# EAGLE design zero shield (EAGLE 6.5.0)
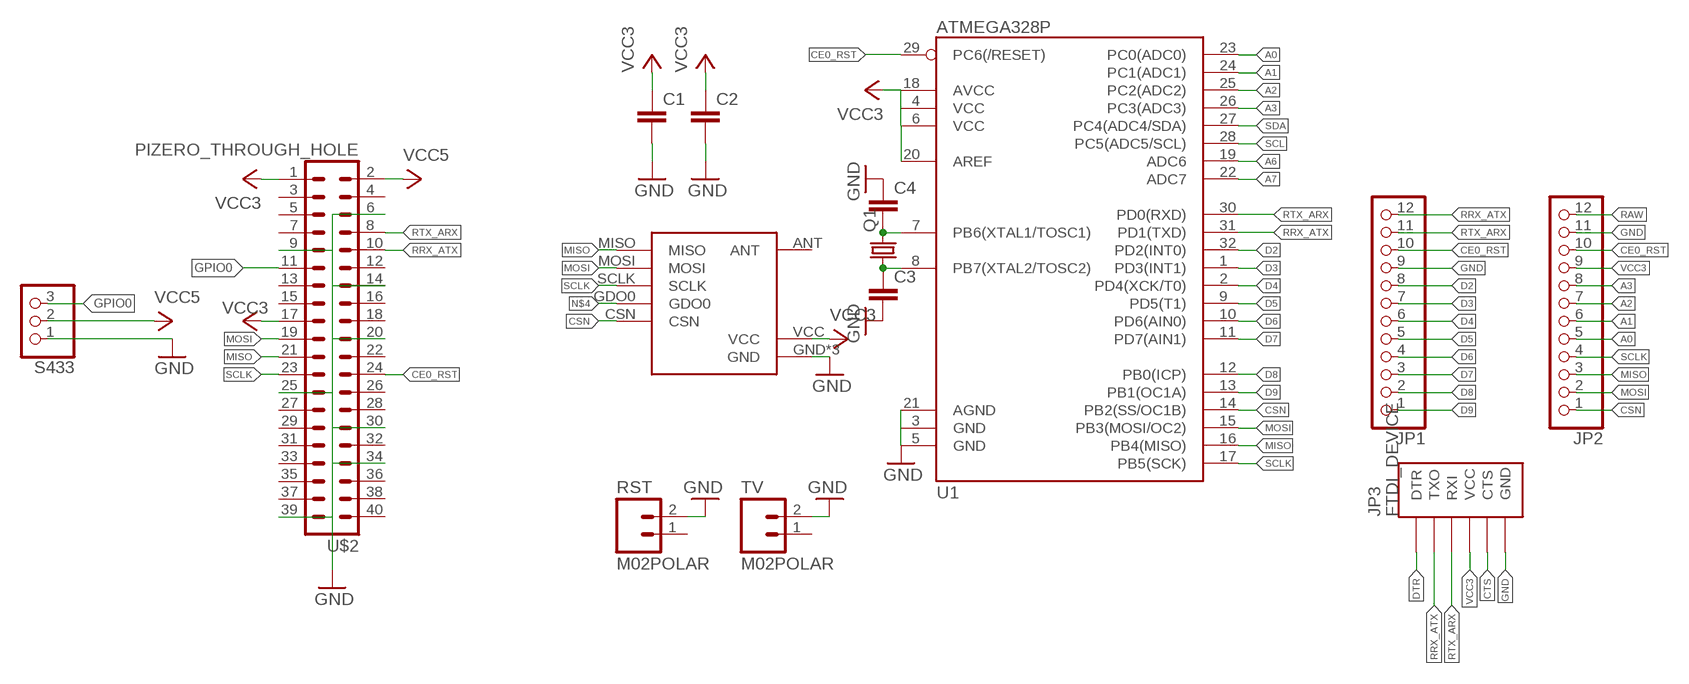
[diagram p0: schematic, sheet 1]

## Parts
C1  C-EUC1206K  [C1206K]
C2  C-EUC1206K  [C1206K]
C3  C-EUC1206K  [C1206K]
C4  C-EUC1206K  [C1206K]
JP1  PINHD-1X12-CB  [1X12-CB]
JP2  PINHD-1X12-CB  [1X12-CB]
JP3  FTDI_DEVICE  [FTDI_DEVICE_SIDE]
Q1  CRYSTALHC49S  [HC49/S]
RST  M02POLAR  [MOLEX-1X2]
S433  PINHD-1X3CB  [1X03-CLEANBIG]
TV  M02POLAR  [MOLEX-1X2]
U1  ATMEGA328P  ATMEGA328_SMT  [TQFP32-08]
U$1  CC1150BOARD  [CC1150BOARD]
U$2  PIZERO_THROUGH_HOLE  [PIZERO_THOUGH_HOLE]

## Nets
A0: JP2.5 U1.23(PC0(ADC0))
A1: JP2.6 U1.24(PC1(ADC1))
A2: JP2.7 U1.25(PC2(ADC2))
A3: JP2.8 U1.26(PC3(ADC3))
A6: U1.19(ADC6)
A7: U1.22(ADC7)
CE0_RST: JP1.10 JP2.10 U1.29(PC6(/RESET)) U$2.24
CSN: JP2.1 U1.14(PB2(SS/OC1B)) U$1.CSN
CTS: JP3.P$5(CTS)
D2: JP1.8 U1.32(PD2(INT0))
D3: JP1.7 U1.1(PD3(INT1))
D4: JP1.6 U1.2(PD4(XCK/T0))
D5: JP1.5 U1.9(PD5(T1))
D6: JP1.4 U1.10(PD6(AIN0))
D7: JP1.3 U1.11(PD7(AIN1))
D8: JP1.2 U1.12(PB0(ICP))
D9: JP1.1 U1.13(PB1(OC1A))
DTR: JP3.P$1(DTR)
GND: C1.2 C2.2 C3.2 C4.1 JP1.9 JP2.11 JP3.P$6(GND) RST.2 S433.1 TV.2 U1.3(GND) U1.5(GND) U1.21(AGND) U$1.GND U$1.GND2(GND) U$1.GND3(GND) U$2.6 U$2.9 U$2.14 U$2.20 U$2.25 U$2.30 U$2.34 U$2.39
GPIO0: S433.3 U$2.11
MISO: JP2.3 U1.16(PB4(MISO)) U$1.MISO U$2.21
MOSI: JP2.2 U1.15(PB3(MOSI/OC2)) U$1.MOSI U$2.19
N$1: C4.2 Q1.2 U1.7(PB6(XTAL1/TOSC1))
N$2: C3.1 Q1.1 U1.8(PB7(XTAL2/TOSC2))
N$4: U$1.GDO0
RAW: JP2.12
RRX_ATX: JP1.12 JP3.P$2(TXO) U1.31(PD1(TXD)) U$2.10
RTX_ARX: JP1.11 JP3.P$3(RXI) U1.30(PD0(RXD)) U$2.8
SCL: U1.28(PC5(ADC5/SCL))
SCLK: JP2.4 U1.17(PB5(SCK)) U$1.SCLK U$2.23
SDA: U1.27(PC4(ADC4/SDA))
VCC3: C1.1 C2.1 JP2.9 JP3.P$4(VCC) U1.4(VCC) U1.6(VCC) U1.18(AVCC) U1.20(AREF) U$1.VCC U$2.1 U$2.17
VCC5: S433.2 U$2.2
Unconnected: RST.1 TV.1 U$1.ANT U$2.3 U$2.4 U$2.5 U$2.7 U$2.12 U$2.13 U$2.15 U$2.16 U$2.18 U$2.22 U$2.26 U$2.27 U$2.28 U$2.29 U$2.31 U$2.32 U$2.33 U$2.35 U$2.36 U$2.37 U$2.38 U$2.40

## Library data of the parts
C1-C4 = rcl:C-EU: CAPACITOR, European symbol
JP1 JP2 = adafruit:PINHD-1X12: PIN HEADER
JP3 = SparkFun-Connectors:FTDI_DEVICE: Connector which mates to FTDI basic or FTDI cable.
Q1 = adafruit:CRYSTAL: CRYSTAL; OC_FARNELL: 1667008; OC_NEWARK: unknown
RST TV = SparkFun-Connectors:M02: Standard 2-pin 0.1" header. Use with - straight break away headers ( PRT-00116) - right angle break away headers (PRT-00553) - swiss pins (PRT-00743) - machine pins (PRT-00117) - female headers (PRT-00115) Molex polarized connector foot print use with: PRT-08233 with associated crimp pins and housings. 2.54_SCREWTERM for use with PRT-10571. 3.5mm Screw Terminal footprints for PRT-08084 5mm Screw Terminal footprints for use with PRT-08432
S433 = adafruit:PINHD-1X3: PIN HEADER
U1 = SparkFun-DigitalIC:ATMEGA328_SMT: 32-Pin Atmega328 part Commonly used on Arduino compatible boards Available in QFP and QFN packages TQFP is IC-09069 QFN is non-stock; PROD_ID: IC-09069
U$1 = CC1150:CC1150BOARD
U$2 = pizero:PIZERO_THROUGH_HOLE

## Board
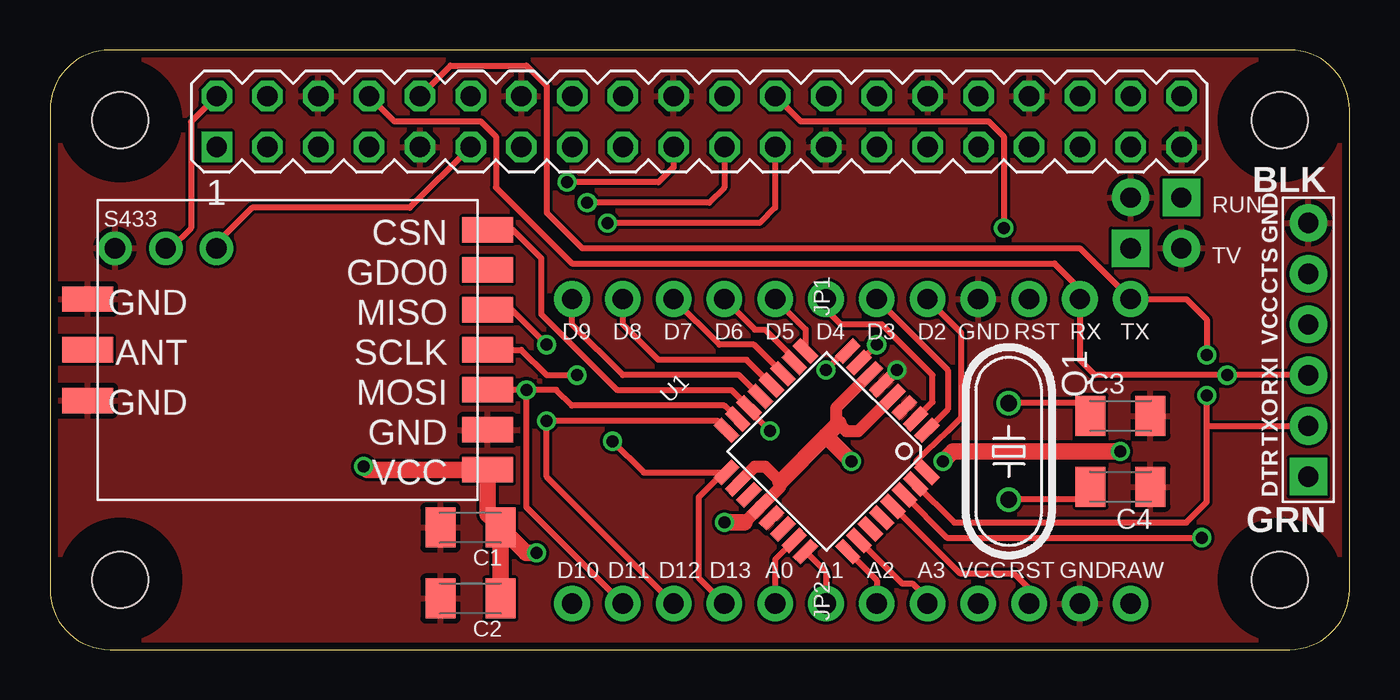
[diagram p1: board, top side]
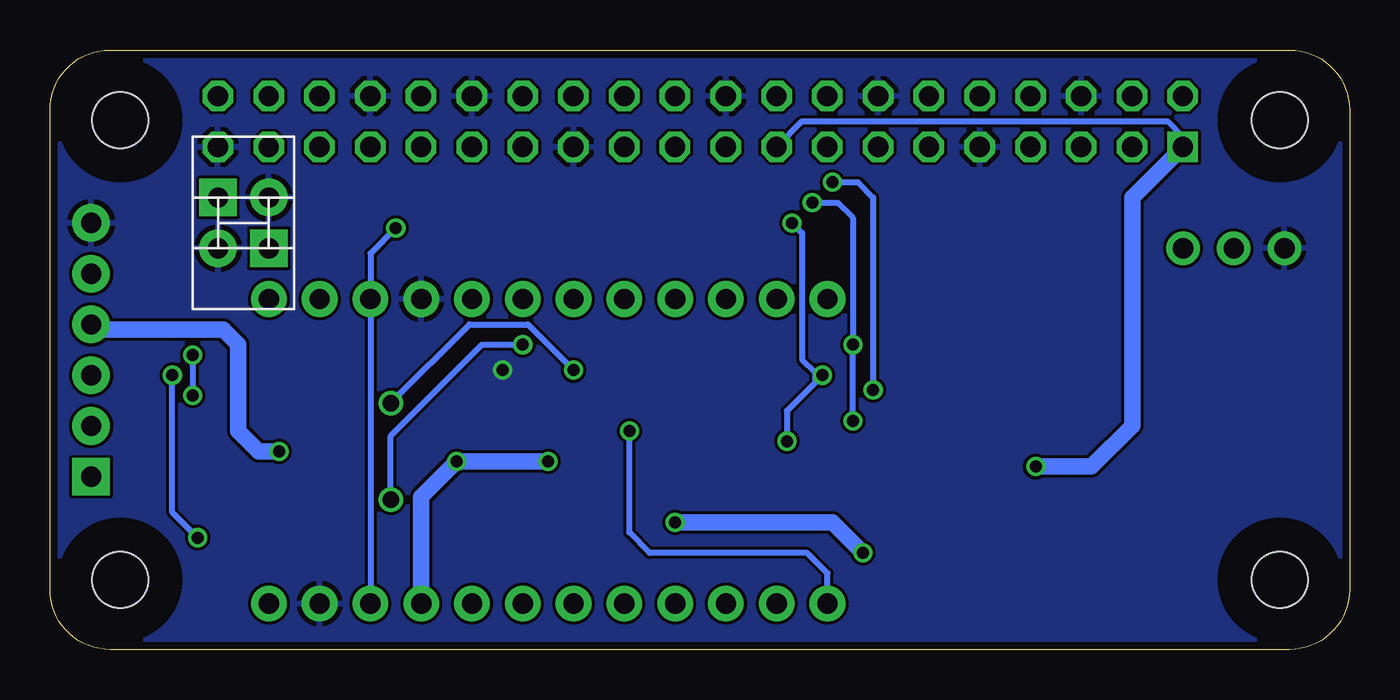
[diagram p2: board, bottom side, seen from below]

Size 65 x 30 mm. Coordinates in mm from the lower left corner, seen from the top.
Copper layers (1*16): Top 0.0356mm / dielectric 1.5011mm / Bottom 0.0356mm
Design rules "LaenPCBOrder": minimum track width 6mil, minimum drill 13mil, track to track 6mil, track to pad 6mil, pad to pad 6mil, via to via 6mil, smd to smd 6mil, copper to edge 15mil, drill to drill 6mil, minimum pad ring 7mil, minimum via ring 7mil, stop-mask expansion 3mil, vias tented up to drill 0mil, thermal gap 10mil

### Footprints (pad centres in the part's own frame; a part is rotated, then mirrored left to right if it is on the bottom)
C1206K = smd 1.5 x 2: 1 -1.5,0; 2 1.5,0
1X12-CB = drill 1.016 pad 1.778: 1 -13.97,0; 2 -11.43,0; 3 -8.89,0; 4 -6.35,0; 5 -3.81,0; 6 -1.27,0; 7 1.27,0; 8 3.81,0; 9 6.35,0; 10 8.89,0; 11 11.43,0; 12 13.97,0
FTDI_DEVICE_SIDE = drill 1.016 pad 1.88 square: P$1 -6.35,0 | drill 1.016 pad 1.88: P$2 -3.81,0; P$3 -1.27,0; P$4 1.27,0; P$5 3.81,0; P$6 6.35,0
HC49/S = drill 0.813: 1 -2.413,0; 2 2.413,0
MOLEX-1X2 = drill 1.016 pad 1.88 square: 1 0,0 | drill 1.016 pad 1.88: 2 2.54,0
1X03-CLEANBIG = drill 1.016 pad 1.676: 1 -2.54,0; 2 0,0; 3 2.54,0
TQFP32-08 = smd 1.27 x 0.559: 1 -4.293,2.8; 2 -4.293,2; 3 -4.293,1.2; 4 -4.293,0.4; 5 -4.293,-0.4; 6 -4.293,-1.2; 7 -4.293,-2; 8 -4.293,-2.8; 17 4.293,-2.8; 18 4.293,-2; 19 4.293,-1.2; 20 4.293,-0.4; 21 4.293,0.4; 22 4.293,1.2; 23 4.293,2; 24 4.293,2.8 | smd 0.559 x 1.27: 9 -2.8,-4.293; 10 -2,-4.293; 11 -1.2,-4.293; 12 -0.4,-4.293; 13 0.4,-4.293; 14 1.2,-4.293; 15 2,-4.293; 16 2.8,-4.293; 25 2.8,4.293; 26 2,4.293; 27 1.2,4.293; 28 0.4,4.293; 29 -0.4,4.293; 30 -1.2,4.293; 31 -2,4.293; 32 -2.8,4.293
CC1150BOARD = smd 1.27 x 2.54: ANT 0,10; CSN 6,-10; GDO0 4,-10; GND -4,-10; GND2 -2.54,10; GND3 2.54,10; MISO 2,-10; MOSI -2,-10; SCLK 0,-10; VCC -6,-10
PIZERO_THOUGH_HOLE = drill 1.016 square: 1 8.34,25.15 | drill 1.016 octagon: 2 8.34,27.69; 3 10.88,25.15; 4 10.88,27.69; 5 13.42,25.15; 6 13.42,27.69; 7 15.96,25.15; 8 15.96,27.69; 9 18.5,25.15; 10 18.5,27.69; 11 21.04,25.15; 12 21.04,27.69; 13 23.58,25.15; 14 23.58,27.69; 15 26.12,25.15; 16 26.12,27.69; 17 28.66,25.15; 18 28.66,27.69; 19 31.2,25.15; 20 31.2,27.69; 21 33.74,25.15; 22 33.74,27.69; 23 36.28,25.15; 24 36.28,27.69; 25 38.82,25.15; 26 38.82,27.69; 27 41.36,25.15; 28 41.36,27.69; 29 43.9,25.15; 30 43.9,27.69; 31 46.44,25.15; 32 46.44,27.69; 33 48.98,25.15; 34 48.98,27.69; 35 51.52,25.15; 36 51.52,27.69; 37 54.06,25.15; 38 54.06,27.69; 39 56.6,25.15; 40 56.6,27.69 | hole 2.8: 3.5,3.5; 3.5,26.5; 61.5,26.5; 61.5,3.5

### Placement (x,y rotation side)
C1  21.03,6.11 180 top
C2  21.03,2.55 180 top
C3  53.54,11.69 0 top
C4  53.54,8.14 180 top
JP1  40.08,17.54 0 top
JP2  40.08,2.3 0 top
JP3  62.94,15 90 top
Q1  47.96,9.92 270 top
RST  56.59,22.62 0 bottom
S433  5.79,20.08 0 top
TV  54.05,20.08 180 bottom
U1  38.85,9.92 225 top
U$1  11.89,15 90 top
U$2  0,0 0 top

### Tracks (layer width: path | path; a pad name or v marks a point on that pad's centre or on a via)
A0
  Top 0.305: U1.23 36.27,4.51 JP2.5
A1
  Top 0.305: U1.24 38.81,3.88 JP2.6
A2
  Top 0.305: U1.25 41.35,3.45 JP2.7
A3
  Top 0.305: U1.26 42.62,3.31 43.13,3.31 43.89,2.55 JP2.8
CE0_RST  (via drill 0.6)
  Top 0.305: U$2.24 37.54,26.43 46.94,26.43 47.7,25.66 v47.7,21.09 | U1.29 45.51,3.82 48.21,3.82 48.97,3.06 JP2.10
  Bottom 0.305: v47.7,21.09 48.97,19.82 JP1.10 JP2.10
CSN  (via drill 0.6)
  Top 0.305: U$1.CSN 23.16,21 24.59,19.57 24.59,16.77 28.4,12.96 34.1,12.96 U1.14 34.96,11.99 v36.02,10.93
  Bottom 0.305: JP2.1 26.11,3.82 27.13,4.84 35,4.84 36.02,5.85 v36.02,10.93
D2
  Top 0.305: JP1.8 45.57,15.86 45.57,11.59 44.91,10.93 43.32,9.41 U1.32
D3
  Top 0.305: JP1.7 44.91,13.98 44.91,12.02 U1.1
D4
  Top 0.305: U1.2 44.15,12.39 44.15,13.73 41.61,16.27 39.57,16.27 39.07,16.77 39.07,17.54 JP1.6
D5
  Top 0.305: JP1.5 37.79,16.02 U1.9
D6
  Top 0.305: JP1.4 35.26,16.01 35.76,16.01 37.23,14.55 U1.10
D7
  Top 0.305: U1.11 35.21,15.25 33.48,15.25 JP1.3
D8
  Top 0.305: U1.12 34.84,14.49 30.43,14.49 28.65,16.27 JP1.2
D9
  Top 0.305: U1.13 34.47,13.73 28.65,13.73 26.11,16.27 JP1.1
GND  (via drill 0.6)
  other vias: 42.37,13.98
  pour Bottom: -2.54,33.02 67.31,33.02 67.31,-2.54 -2.54,-2.54
  pour Top: -1.27,31.75 -1.27,-1.27 66.04,-1.27 66.04,31.75
GPIO0
  Top 0.305: U$2.11 18,22.11 10.11,22.11 8.33,20.33 S433.3
MISO  (via drill 0.6)
  Top 0.305: v24.84,15.25 23.06,17.03 22.3,17.03 21.89,17.12 U$1.MISO | 33.83,10.78 U1.16 33.36,11.44 v24.84,11.44 24.84,8.65 JP2.3 | U$2.21 33.73,23.12 32.97,22.36 v26.87,22.36
  Bottom 0.305: v24.84,11.44 v24.84,15.25 24.84,21.6 25.6,22.36 v26.87,22.36
MOSI  (via drill 0.6)
  Top 0.305: U1.15 33.73,12.2 26.11,12.2 25.32,13 v23.83,13 | v23.83,13 U$1.MOSI | JP2.2 23.83,7.12 v23.83,13 | U$2.19 31.19,24.13 31.18,24.13 30.43,23.38 v25.86,23.38
  Bottom 0.305: v25.86,23.38 24.59,23.38 23.83,22.62 v23.83,13
N$1  (via drill 0.6)
  Top 0.305: C4.2 51.41,7.5 Q1.2 | v41.35,15.25 40.72,14.62 U1.7
  Bottom 0.305: Q1.2 47.96,10.68 43.38,15.25 v41.35,15.25
N$2  (via drill 0.6)
  Top 0.305: C3.1 51.41,12.33 Q1.1 | v38.81,13.98 39.76,14.93 U1.8
  Bottom 0.305: Q1.1 44.02,16.27 41.1,16.27 v38.81,13.98
RRX_ATX  (via drill 0.6)
  Top 0.305: 57.86,11.19 JP3.P$2 | v57.86,14.74 57.86,16.52 56.85,17.54 JP1.12 51.51,20.08 26.62,20.08 24.84,21.85 24.84,28.2 23.83,29.22 20.03,29.22 U$2.10 | U1.31 45.23,6.36 56.85,6.36 57.86,7.38 57.86,11.19 | 57.86,11.19 v57.86,12.71
  Bottom 0.305: v57.86,14.74 v57.86,12.71
RTX_ARX  (via drill 0.6)
  Top 0.305: JP3.P$3 v58.88,13.73 52.27,13.73 51.51,14.49 JP1.11 51.51,18.04 50.24,19.31 26.11,19.31 22.3,23.12 22.3,25.66 21.54,26.43 17.22,26.43 U$2.8 | U1.30 44.86,5.6 v57.61,5.6
  Bottom 0.305: v57.61,5.6 58.88,6.87 v58.88,13.73
SCLK  (via drill 0.6)
  Top 0.305: JP2.4 32.46,3.57 32.46,7.63 33.69,8.86 U1.17 29.71,8.86 v28.14,10.42 | U$1.SCLK 23.57,15 24.84,13.73 v26.37,13.73 | U$2.23 36.27,22.11 35.51,21.35 v27.89,21.35
  Bottom 0.305: v26.37,13.73 26.75,13.35 | 26.75,13.35 28.14,11.95 v28.14,10.42 | v27.89,21.35 27.38,20.84 27.38,14.49 26.75,13.85 26.75,13.35
VCC3  (via drill 0.6)
  Top 0.305: 39.32,11.44 39.45,11.31 | 42.17,12.67 U1.4 | 35.55,7.16 U1.20
  Top 0.61: U1.6 39.32,12.09 39.32,11.44 | 39.45,11.31 39.83,10.93 40.44,10.93 42.17,12.67 | U1.18 35.26,9.15 35.76,9.15 36.53,8.39 36.53,8.14 35.55,7.16 | 34.75,6.36 35.53,7.14 U1.20
  Top 0.813: C1.1 21.89,6.75 U$1.VCC 15.86,9 v15.7,9.15 | C1.1 C2.1 | 36.53,8.39 38.81,10.68 | 38.81,10.68 39.45,11.31 | C1.1 23.8,4.84 v24.33,4.84 | v33.73,6.36 34.75,6.36 | v40.08,9.41 38.81,10.68 | v53.54,9.92 45.16,9.92 v44.65,9.41
  Bottom 0.305: U$2.17 27.38,26.43 9.09,26.43 8.34,25.67 U$2.1
  Bottom 0.813: U$2.1 10.87,22.62 10.87,11.19 12.9,9.15 v15.7,9.15 | v24.33,4.84 25.86,6.36 v33.73,6.36 | JP3.P$4 62.69,16.01 56.34,16.01 55.58,15.25 55.58,10.93 54.56,9.92 v53.54,9.92 | v40.08,9.41 v44.65,9.41 46.43,7.63 JP2.9
VCC5
  Top 0.305: U$2.2 7.06,26.41 7.06,21.09 6.05,20.08 S433.2

### Text on the board
tNames: RUN | TV | D9 | D8 | D7 | D6 | D5 | D4 | D3 | D2 | GND | RST | RX | TX | D10 | D11 | D12 | D13 | A0 | A1 | A2 | A3 | VCC | RST | GND | RAW